# EAGLE schematic ATTiny10DevBrd (EAGLE 6.4)
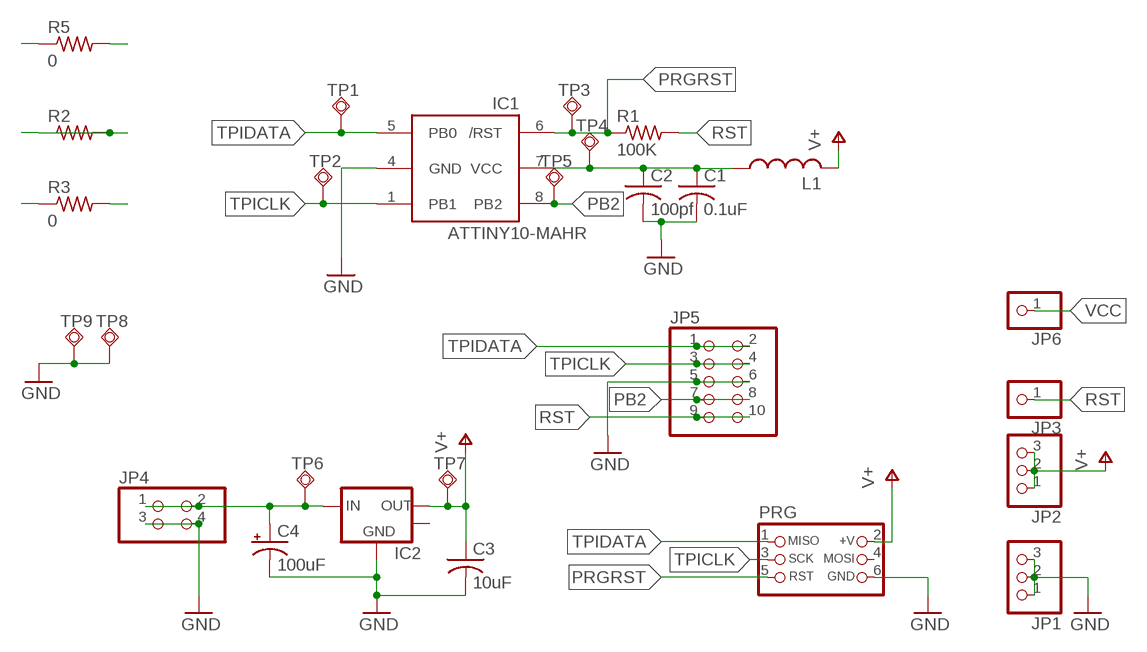
[diagram p0: schematic, sheet 1]

## Parts
C1  0.1uF  C-USC0603  [C0603]
C2  100pf  C-USC0402  [C0402]
C3  10uF  C-USC0805K  [C0805K]
C4  100uF  CPOL-USE  [PANASONIC_E]
IC1  ATTINY10-MAHR  [UDFN-8]
IC2  V_REG_LM1117SOT223  [SOT223]
JP1  PINHD-1X3  [1X03]
JP2  PINHD-1X3  [1X03]
JP3  PINHD-1X1  [1X01]
JP4  PINHD-2X2  [2X02]
JP5  PINHD-2X5  [2X05]
JP6  PINHD-1X1  [1X01]
L1  L-USL1812  [L1812]
PRG  CON_HEADER_PRG_AVR_ICSP_ETCH  [HEADER_PRG_2X03_ETCH]
R1  100K  R-US_R0805  [R0805]
R2  R-US_M1206  [M1206]
R3  0  R-US_M1206  [M1206]
R5  0  R-US_R0805  [R0805]
TP1  TPSQTP12R  [TP12R]
TP2  TPSQTP12R  [TP12R]
TP3  TPSQTP12R  [TP12R]
TP4  TPSQTP12R  [TP12R]
TP5  TPSQTP12R  [TP12R]
TP6  TPSQTP12R  [TP12R]
TP7  TPSQTP12R  [TP12R]
TP8  TPSQTP12R  [TP12R]
TP9  TPSQTP12R  [TP12R]

## Nets
GND: C1.2 C2.2 C3.2 C4.- IC1.4(GND) IC2.1(GND) JP1.1 JP1.2 JP1.3 JP4.3 JP4.4 JP5.5 JP5.6 PRG.6(GND) TP8.TP TP9.TP
PB2: IC1.8(PB2) JP5.7 JP5.8 R3.1 R3.2 TP5.TP
PRGRST: IC1.6(/RST) PRG.5(RST) R1.1 TP3.TP
RST: JP3.1 JP5.9 JP5.10 R1.2
TPICLK: IC1.1(PB1) JP5.3 JP5.4 PRG.3(SCK) R2.1 R2.2 TP2.TP
TPIDATA: IC1.5(PB0) JP5.1 JP5.2 PRG.1(MISO) R5.1 R5.2 TP1.TP
V+: C3.1 IC2.2(VR-OUTSM) JP2.1 JP2.2 JP2.3 L1.2 PRG.2(+V) TP7.TP
VCC: C1.1 C2.1 IC1.7(VCC) JP6.1 L1.1 TP4.TP
VIN: C4.+ IC2.3(IN) JP4.1 JP4.2 TP6.TP
Unconnected: IC2.4(OUT) PRG.4(MOSI)

## Library data of the parts
C1 C2 = adafruit:C-US: CAPACITOR, American symbol
C3 = LL:C-US: CAPACITOR, American symbol
C4 = LL:CPOL-US: POLARIZED CAPACITOR, American symbol Footprints somewhat modified from Adafruits (1206)
IC1 = LL:ATTINY10: ATtiny4/5/9/10 8-bit Microcontroller with 512/1024 Bytes In-System Programmable Flash (Derived from adafruit's, but made for etch)
IC2 = LL:V_REG_LM1117: Voltage Regulator LM1117 Standard adjustable voltage regulator but in SMD form. Fixed voltage type.
JP1 JP2 = adafruit:PINHD-1X3: PIN HEADER
JP3 JP6 = adafruit:PINHD-1X1: Pin header 1x1 for 0.1" spacing With round pins
JP4 = pinhead:PINHD-2X2: PIN HEADER
JP5 = pinhead:PINHD-2X5: PIN HEADER
L1 = LL:L-US: INDUCTOR, American symbol
PRG = LL:CON_HEADER_PRG_AVR_ICSP_ETCH: 2x3 AVR ICSP programming header for etching
R1-R3 R5 = LL:R-US_: RESISTOR, American symbol
TP1-TP9 = testpad:TPSQ: Test pad